# EasyEDA Pro project ProProject_Access Control Core_2024-06-07.epro, board V2.2.1 PCB
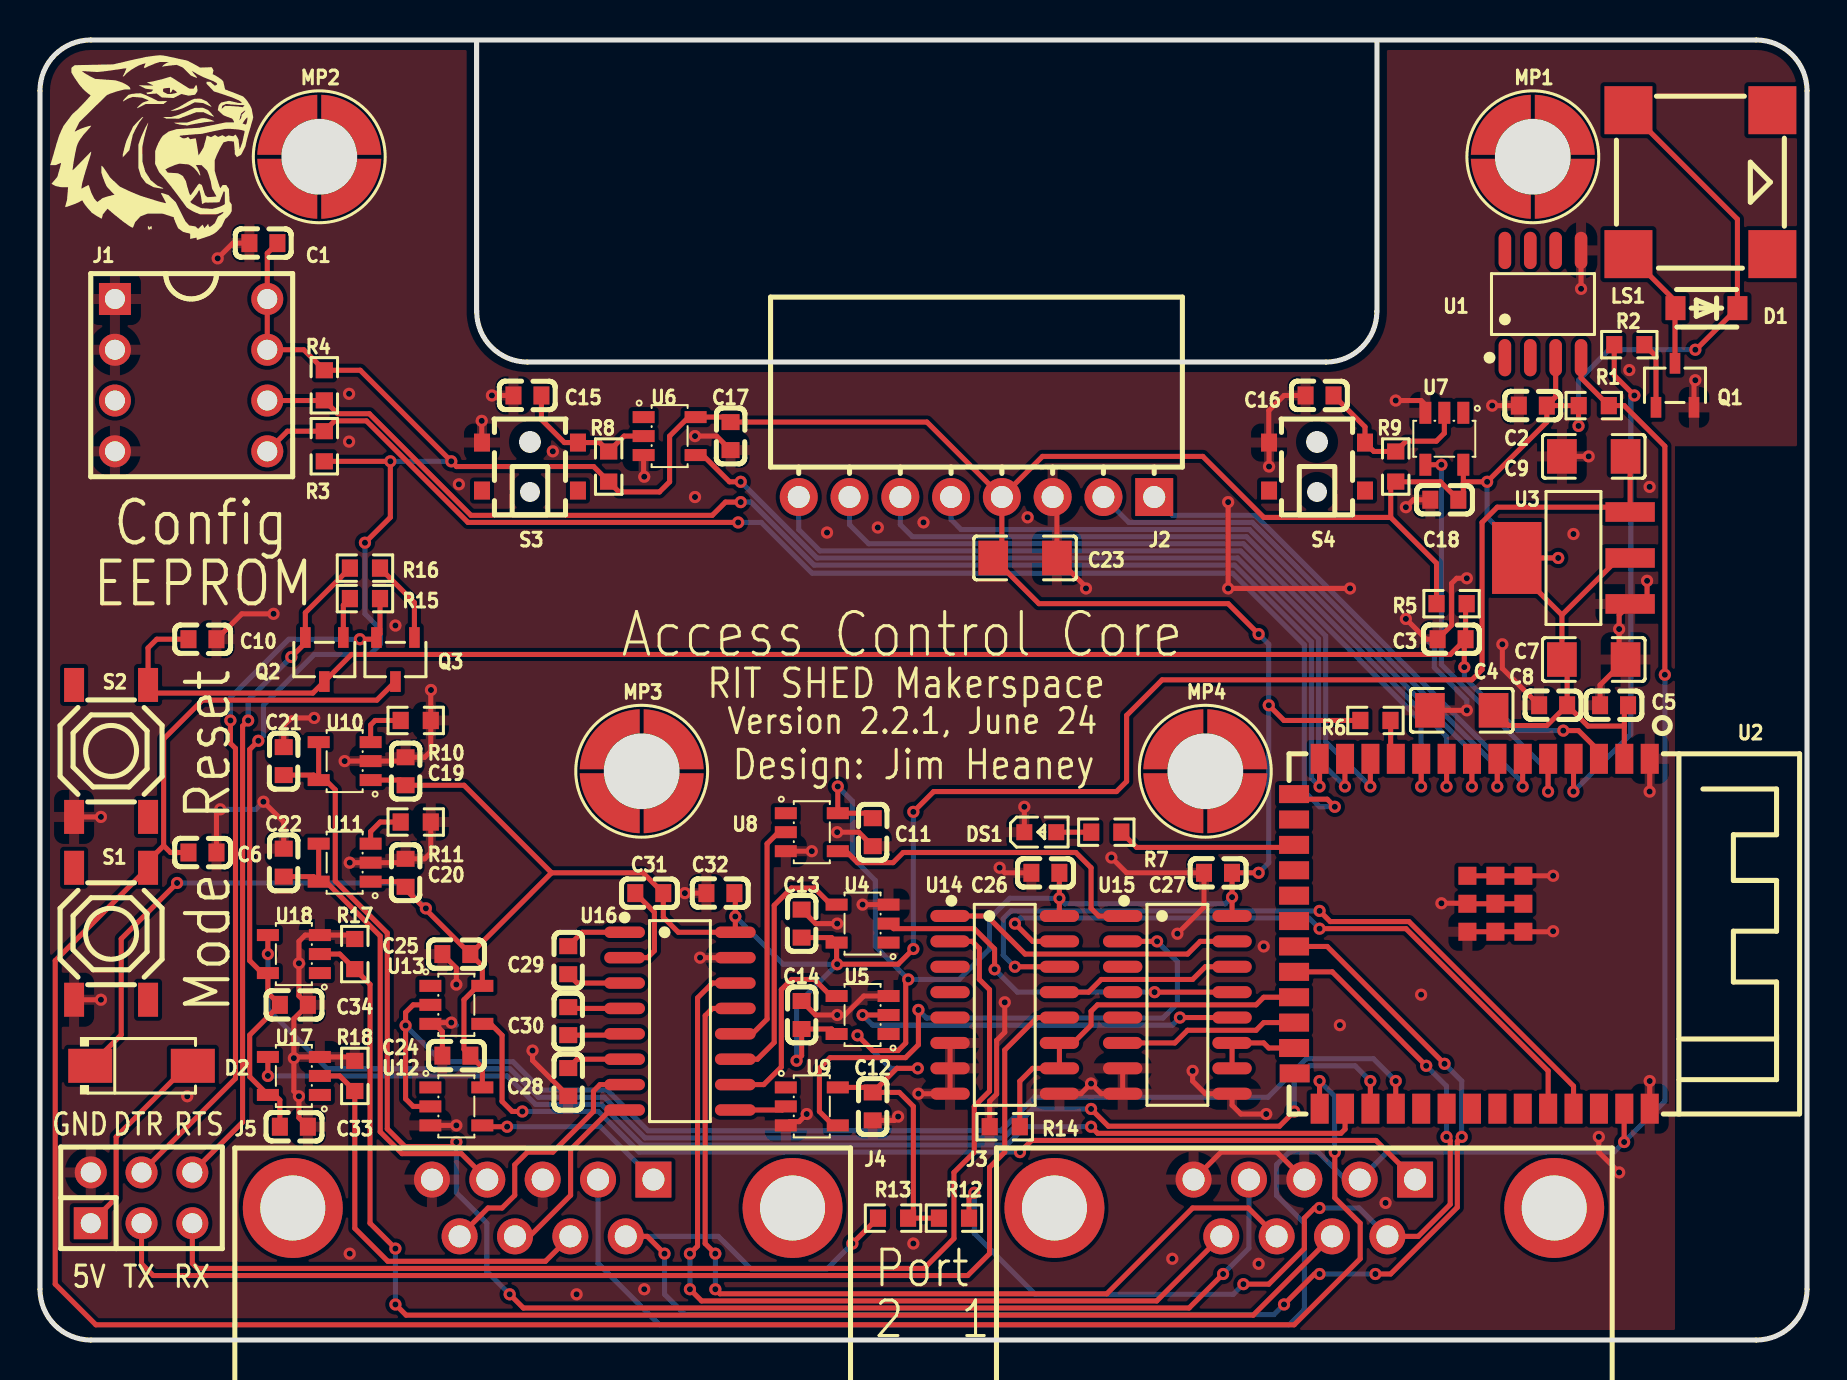
[diagram p15: board, top side]
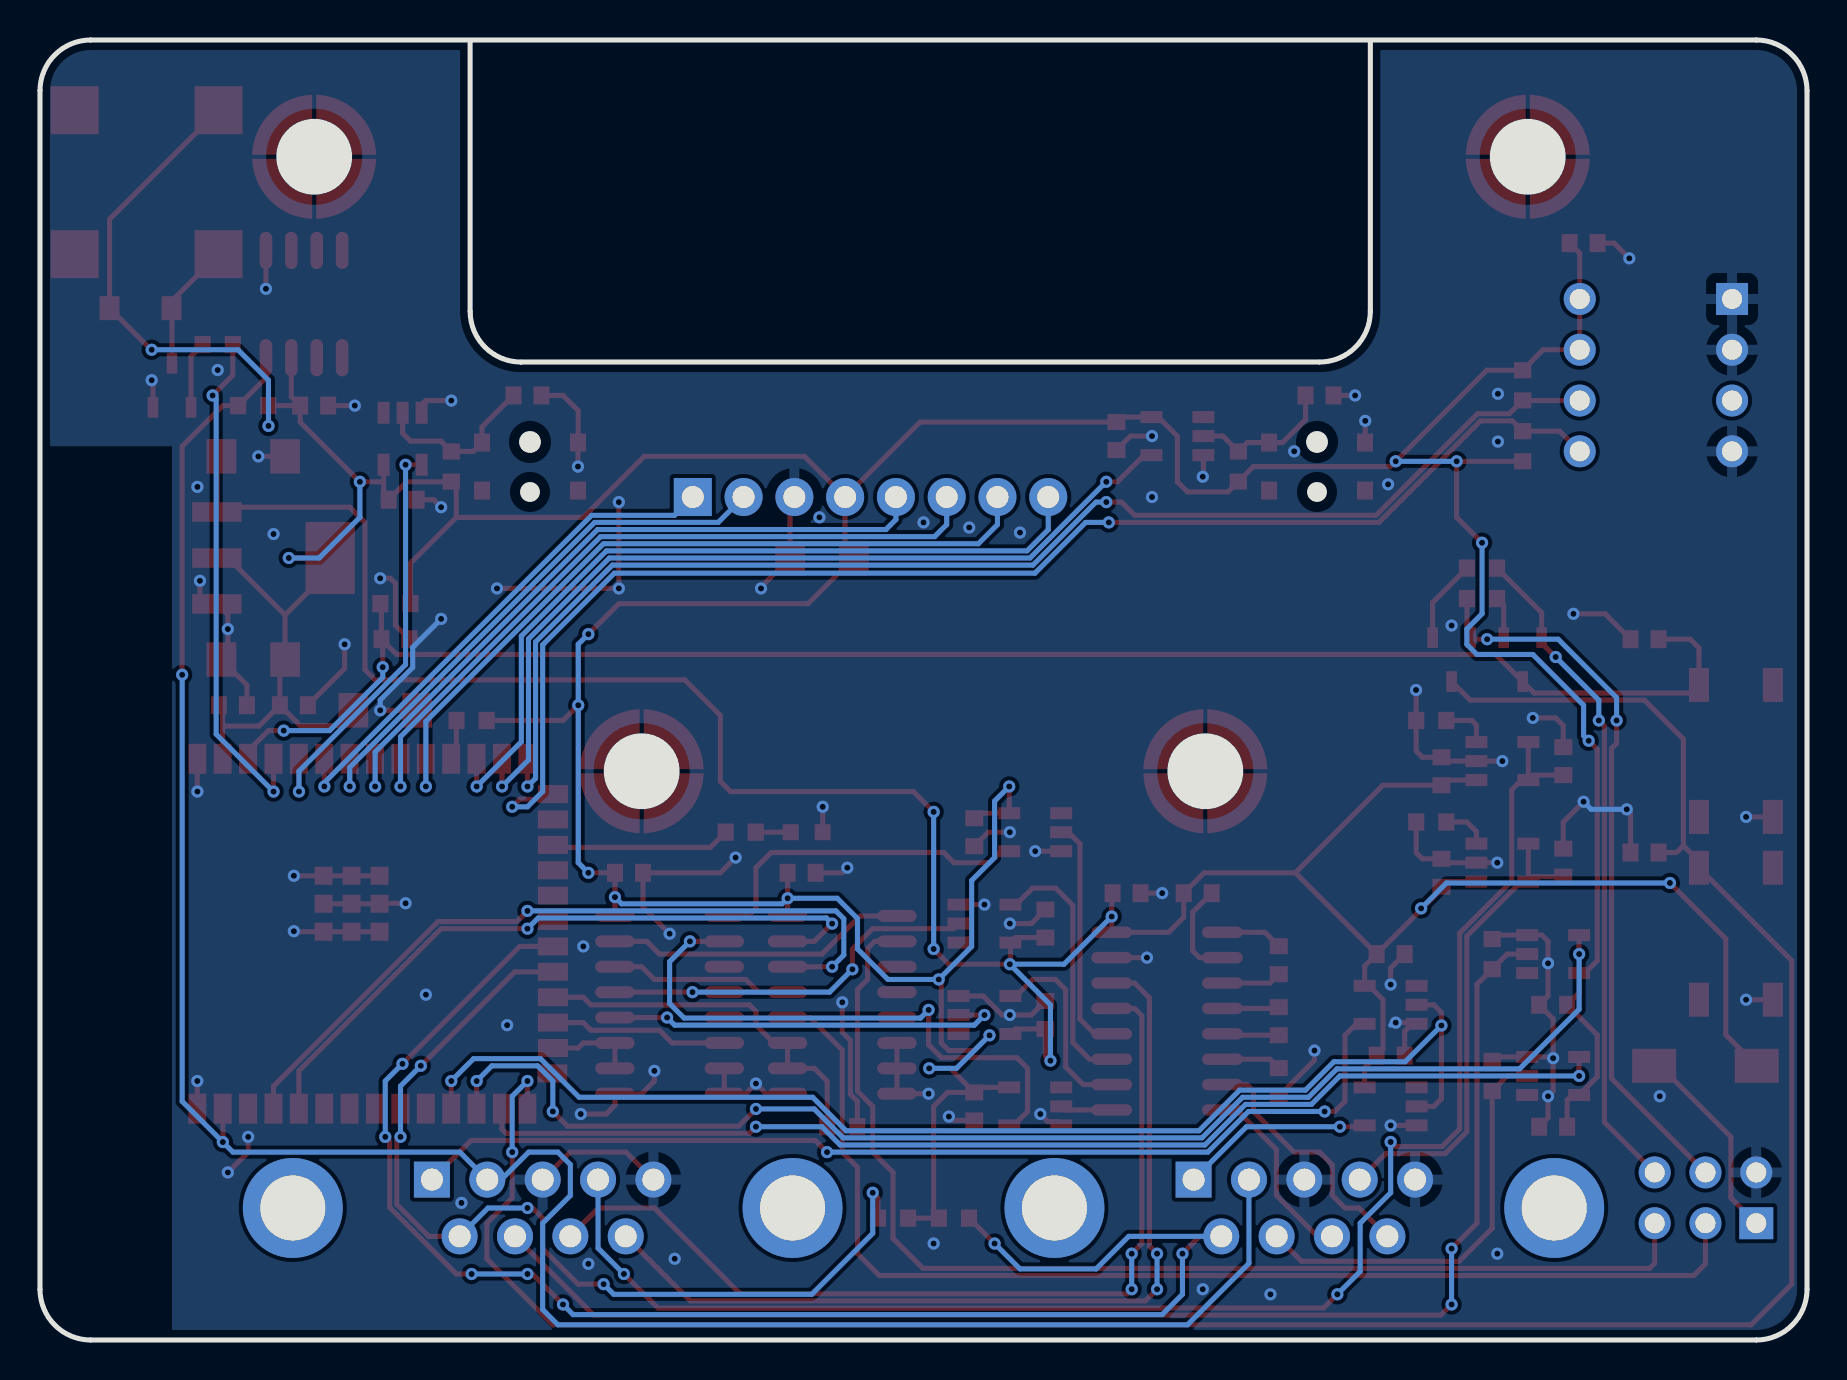
[diagram p16: board, bottom side, seen from below]

Outline 88.39 x 65.02 mm; copper layers: Top Layer, Bottom Layer. Coordinates in mm from the lower left corner of the outline.
Outline path: 21.84,64.98 21.84,51.46 arc(22.59,49.66) 24.38,48.92 64.34,48.92 arc(66.13,49.66) 66.88,51.46 66.88,65 ; 0,62.48 0,2.54 arc(0.74,0.74) 2.54,0 85.85,0 arc(87.65,0.74) 88.39,2.54 88.39,62.48 arc(87.65,64.28) 85.85,65.02 2.54,65.02 arc(0.74,64.28) 0,62.48
Stack: Top Layer 0.035mm / Dielectric1 1.51mm FR4 er 4.5 / Bottom Layer 0.035mm

## Design rules (mm)
template: Custom Config
spacing copperThickness1oz (default): track to track 0.102, other pairs 0.152 to 0.5
spacing copperThickness2oz: track to track 0.203, other pairs 0.152 to 0.3
track width copperThickness1oz (default): min 0.127, default 0.254, max 2.54
track width copperThickness2oz: min 0.203, default 0.254, max 2.54
differential pair differentialPair (default): width min 0.127, default 0.254, max 2.54; gap min 0.152, default 0.152
via viaSize (default): diameter min 0.5, default 0.61, max 10; hole min 0.3, default 0.305, max 6.3

## Placement (name value [footprint] x y rotation side)
C1  100nF  [C0603]  11.18 54.86 0 top
C2  100nF  [C0603]  74.68 46.74 0 top
C3  1uF  [C0603]  70.61 35.05 0 top
C4  22uF  [C1206]  71.12 31.5 0 top
C5  1uF  [C0603]  78.74 31.75 0 top
C6  100nF  [C0603]  8.13 24.38 180 top
C7  22uF  [C1206]  77.72 34.04 180 top
C8  100nF  [C0603]  75.69 31.75 0 top
C9  22uF  [C1206]  77.72 44.2 0 top
C10  100nF  [C0603]  8.13 35.05 180 top
C11  100nF  [C0603]  41.66 25.4 90 top
C12  100nF  [C0603]  41.66 11.68 90 top
C13  100nF  [C0603]  38.1 20.83 270 top
C14  100nF  [C0603]  38.1 16.26 270 top
C15  100nF  [C0603]  24.38 47.24 0 top
C16  100nF  [C0603]  64.01 47.24 0 top
C17  100nF  [C0603]  34.54 45.21 270 top
C18  100nF  [C0603]  70.25 42.03 180 top
C19  10uF  [C0603]  18.29 28.45 270 top
C20  10uF  [C0603]  18.29 23.37 270 top
C21  10uF  [C0603]  12.19 28.96 90 top
C22  10uF  [C0603]  12.19 23.88 90 top
C23  22uF  [C1206]  49.28 39.12 180 top
C24  100nF  [C0603]  20.83 14.22 180 top
C25  100nF  [C0603]  20.83 19.3 180 top
C26  100nF  [C0603]  50.29 23.37 180 top
C27  100nF  [C0603]  58.93 23.37 180 top
C28  1uF  [C0603]  26.43 12.9 90 top
C29  1uF  [C0603]  26.43 19 90 top
C30  1uF  [C0603]  26.43 15.95 90 top
C31  1uF  [C0603]  30.48 22.35 180 top
C32  1uF  [C0603]  34.04 22.35 0 top
C33  100nF  [C0603]  12.7 10.67 180 top
C34  100nF  [C0603]  12.7 16.76 180 top
D1  SM4007PL  [SOD-123F_L2.8-W1.8-LS3.7-RD]  83.36 51.61 180 top
D2  SS14  [SMA_L4.2-W2.6-LS5.3-RD]  5.08 13.72 0 top
DS1  KT-0603R  [LED0603-RD]  50.04 25.4 0 top
J1  IC-8P  [DIP-8_L10.2-W10.1-P2.54-LS7.6-BL]  7.56 48.26 270 top
J2  PM254-1-08-W-8.5  [HDR-TH_8P-P2.54-H-F-W10.0-N]  46.85 42.16 180 top
J3  D-SUB-DR-9PCM-CB  [DB9-TH_ID09S33E4GV00LF]  63.25 6.6 0 top
J4  D-SUB-DR-9PCM-CB  [DB9-TH_ID09S33E4GV00LF]  25.15 6.6 0 top
J5  DW254R-22-06-85  [HDR-TH_6P-P2.54-V-F-R2-C3-S2.54]  5.08 7.11 0 top
LS1  2.7kHz  [BUZ-SMD_4P-L8.5-W8.5-P8.50-TL]  83.06 57.91 0 top
MP1  SMTSO2070CTJ  [SMD_BD5.6-L5.6-W5.6-D3.6]  74.68 59.18 180 top
MP2  SMTSO2070CTJ  [SMD_BD5.6-L5.6-W5.6-D3.6]  13.97 59.18 0 top
MP3  SMTSO2070CTJ  [SMD_BD5.6-L5.6-W5.6-D3.6]  30.1 28.45 0 top
MP4  SMTSO2070CTJ  [SMD_BD5.6-L5.6-W5.6-D3.6]  58.29 28.45 0 top
Q1  S8050 J3Y  [SOT-23-3_L3.0-W1.7-P0.95-LS2.9-BR]  81.79 47.75 270 top
Q2  S8050 J3Y  [SOT-23-3_L3.0-W1.7-P0.95-LS2.9-BR]  14.22 34.04 90 top
Q3  S8050 J3Y  [SOT-23-3_L3.0-W1.7-P0.95-LS2.9-BR]  17.78 34.04 90 top
R1  4.7kΩ  [R0603]  77.72 46.74 180 top
R2  1kΩ  [R0603]  79.5 49.78 0 top
R3  10kΩ  [R0603]  14.22 44.7 270 top
R4  10kΩ  [R0603]  14.22 47.75 90 top
R5  10kΩ  [R0603]  70.61 36.83 180 top
R6  10kΩ  [R0603]  66.8 30.99 180 top
R7  4.7kΩ  [R0603]  53.34 25.4 0 top
R8  100kΩ  [R0603]  28.45 43.69 270 top
R9  100kΩ  [R0603]  67.82 43.69 270 top
R10  10kΩ  [R0603]  18.8 30.99 0 top
R11  10kΩ  [R0603]  18.8 25.91 0 top
R12  5.1kΩ  [R0603]  45.72 6.1 180 top
R13  5.1kΩ  [R0603]  42.67 6.1 0 top
R14  10kΩ  [R0603]  48.26 10.67 0 top
R15  10kΩ  [R0603]  16.26 37.08 180 top
R16  10kΩ  [R0603]  16.26 38.61 0 top
R17  10kΩ  [R0603]  15.75 19.3 90 top
R18  10kΩ  [R0603]  15.75 13.21 90 top
S1  TS-1187A-B-A-B  [SW-SMD_4P-L5.1-W5.1-P3.70-LS6.5-TL-2]  3.56 20.32 270 top
S2  TS-1187A-B-A-B  [SW-SMD_4P-L5.1-W5.1-P3.70-LS6.5-TL-2]  3.56 29.46 270 top
S3  TS-103  [SW-SMD_TS-103]  24.51 43.69 90 top
S4  TS-103  [SW-SMD_TS-103]  63.88 43.69 90 top
U1  DS18B20Z  [SOP-8_L4.9-W3.9-P1.27-LS6.0-BL]  75.18 51.82 0 top
U2  2.4GHz  [WIRELM-SMD_ESP32-S3-WROOM-1]  71.63 20.32 270 top
U3  AMS1117-3.3  [SOT-223-4_L6.5-W3.5-P2.30-LS7.0-BR]  76.71 39.12 0 top
U4  SN74LVC1G17DBVR  [SOT-23-5_L3.0-W1.7-P0.95-LS2.8-BR]  41.15 20.83 0 top
U5  SN74LVC1G17DBVR  [SOT-23-5_L3.0-W1.7-P0.95-LS2.8-BR]  41.15 16.26 0 top
U6  SN74LVC1G17DBVR  [SOT-23-5_L3.0-W1.7-P0.95-LS2.8-BR]  31.5 45.21 180 top
U7  SN74LVC1G17DBVR  [SOT-23-5_L3.0-W1.7-P0.95-LS2.8-BR]  70.25 45.08 90 top
U8  SN74LVC1G17DBVR  [SOT-23-5_L3.0-W1.7-P0.95-LS2.8-BR]  38.61 25.4 180 top
U9  SN74LVC1G17DBVR  [SOT-23-5_L3.0-W1.7-P0.95-LS2.8-BR]  38.61 11.68 180 top
U10  MT9700  [SOT-23-5_L3.0-W1.7-P0.95-LS2.8-BR]  15.24 28.96 0 top
U11  MT9700  [SOT-23-5_L3.0-W1.7-P0.95-LS2.8-BR]  15.24 23.88 0 top
U12  SN74LVC1G17DBVR  [SOT-23-5_L3.0-W1.7-P0.95-LS2.8-BR]  20.83 11.68 180 top
U13  SN74LVC1G17DBVR  [SOT-23-5_L3.0-W1.7-P0.95-LS2.8-BR]  20.83 16.76 180 top
U14  74HC4053D,653  [SOIC-16_L9.9-W3.9-P1.27-LS6.0-BL]  48.26 16.76 270 top
U15  74HC4053D,653  [SOIC-16_L9.9-W3.9-P1.27-LS6.0-BL]  56.9 16.76 270 top
U16  MAX232EESE-HXY  [SOP-16_L9.9-W3.9-P1.27-LS6.0-BL]  32.01 15.95 270 top
U17  SN74LVC1G17DBVR  [SOT-23-5_L3.0-W1.7-P0.95-LS2.8-BR]  12.7 13.21 0 top
U18  SN74LVC1G17DBVR  [SOT-23-5_L3.0-W1.7-P0.95-LS2.8-BR]  12.7 19.3 0 top

## Footprints (pads in the part's own frame, mm; a bottom-side part is the same pattern mirrored in y, then rotated)
BUZ-SMD_4P-L8.5-W8.5-P8.50-TL
  rect 2.4x2.4 smd: 1(-3.6,3.6) 2(-3.6,-3.6) 3(3.599,-3.599) 4(3.6,3.6)
C0603
  rect 0.8x0.9 smd: 1(-0.7,0) 2(0.7,0)
C1206
  rect 1.485x1.728 smd: 1(-1.593,0) 2(1.593,0)
DB9-TH_ID09S33E4GV00LF
  rect 1.8x1.8 hole 1.1: 1(5.54,1.42)
  round 1.8 hole 1.1: 2(2.77,1.42) 3(0,1.42) 4(-2.77,1.42) 5(-5.54,1.42) 6(4.155,-1.42) 7(1.385,-1.42) 8(-1.385,-1.42) 9(-4.155,-1.42)
  round 5 hole 3.25: 10(-12.5,0) 11(12.5,0)
DIP-8_L10.2-W10.1-P2.54-LS7.6-BL
  rect 1.6x1.6 hole 1: 1(-3.81,-3.81)
  round 1.6 hole 1: 2(-1.27,-3.81) 3(1.27,-3.81) 4(3.81,-3.81) 5(3.81,3.81) 6(1.27,3.81) 7(-1.27,3.81) 8(-3.81,3.81)
HDR-TH_6P-P2.54-V-F-R2-C3-S2.54
  rect 1.7x1.6 hole 1: 1(-2.54,-1.27)
  round 1.6 hole 1: 2(-2.54,1.27) 3(0,-1.27) 4(0,1.27) 5(2.54,-1.27) 6(2.54,1.27)
HDR-TH_8P-P2.54-H-F-W10.0-N
  rect 1.9x1.9 hole 1.1: 1(-8.89,0)
  round 1.9 hole 1.1: 2(-6.35,0) 3(-3.81,0) 4(-1.27,0) 5(1.27,0) 6(3.81,0) 7(6.35,0) 8(8.89,0)
LED0603-RD
  rect 0.8x0.8 smd: 1(-0.799,0) 2(0.799,0)
R0603
  rect 0.806x0.864 smd: 1(-0.753,0) 2(0.753,0)
SMA_L4.2-W2.6-LS5.3-RD
  rect 2.2x1.7 smd: 1(-2.566,0) 2(2.566,0)
SMD_BD5.6-L5.6-W5.6-D3.6
  custom 3x3 smd: 1(-1.844,1.6) 1(-1.601,-1.844) 1(1.6,1.844) 1(1.844,-1.6)
SOD-123F_L2.8-W1.8-LS3.7-RD
  rect 1x1.2 smd: 1(-1.55,0) 2(1.55,0)
SOIC-16_L9.9-W3.9-P1.27-LS6.0-BL
  oval 0.602x1.971 smd: 1(-4.445,-2.736) 2(-3.175,-2.736) 3(-1.905,-2.736) 4(-0.635,-2.736) 5(0.635,-2.736) 6(1.905,-2.736) 7(3.175,-2.736) 8(4.445,-2.736) 9(4.445,2.736) 10(3.175,2.736) 11(1.905,2.736) 12(0.635,2.736) 13(-0.635,2.736) 14(-1.905,2.736) 15(-3.175,2.736) 16(-4.445,2.736)
SOP-8_L4.9-W3.9-P1.27-LS6.0-BL
  oval 0.63x1.865 smd: 1(-1.905,-2.683) 2(-0.635,-2.683) 3(0.635,-2.683) 4(1.905,-2.683) 5(1.905,2.683) 6(0.635,2.683) 7(-0.635,2.683) 8(-1.905,2.683)
SOP-16_L9.9-W3.9-P1.27-LS6.0-BL
  oval 0.574x2.038 smd: 1(-4.445,-2.769) 2(-3.175,-2.769) 3(-1.905,-2.769) 4(-0.635,-2.769) 5(0.635,-2.769) 6(1.905,-2.769) 7(3.175,-2.769) 8(4.445,-2.769) 9(4.445,2.769) 10(3.175,2.769) 11(1.905,2.769) 12(0.635,2.769) 13(-0.635,2.769) 14(-1.905,2.769) 15(-3.175,2.769) 16(-4.445,2.769)
SOT-23-3_L3.0-W1.7-P0.95-LS2.9-BR
  rect 1.038x0.532 smd: 1(1.101,-0.95) 2(1.101,0.95) 3(-1.101,0)
SOT-23-5_L3.0-W1.7-P0.95-LS2.8-BR
  rect 1.1x0.6 smd: 1(1.3,-0.95) 2(1.3,0) 3(1.3,0.95) 4(-1.3,0.95) 5(-1.3,-0.95)
SOT-223-4_L6.5-W3.5-P2.30-LS7.0-BR
  rect 2.47x0.98 smd: 1(2.835,-2.3) 2(2.835,0) 3(2.835,2.3)
  rect 2.47x3.6 smd: 4(-2.835,0)
SW-SMD_4P-L5.1-W5.1-P3.70-LS6.5-TL-2
  rect 1.7x1 smd: 1(-3.3,1.85) 2(3.3,1.85) 3(-3.3,-1.85) 4(3.3,-1.85)
SW-SMD_TS-103
  rect 0.9x0.8 smd: 1(1.2,2.4) 2(1.2,-2.4) 3(-1.2,2.4) 4(-1.2,-2.4)
WIRELM-SMD_ESP32-S3-WROOM-1
  rect 1.5x0.9 smd: 1(-8.75,8.895) 2(-8.75,7.625) 3(-8.75,6.355) 4(-8.75,5.085) 5(-8.75,3.815) 6(-8.75,2.545) 7(-8.75,1.275) 8(-8.75,0.005) 9(-8.75,-1.265) 10(-8.75,-2.535) 11(-8.75,-3.805) 12(-8.75,-5.075) 13(-8.75,-6.345) 14(-8.75,-7.615) 27(8.75,-7.615) 28(8.75,-6.345) 29(8.75,-5.075) 30(8.75,-3.805) 31(8.75,-2.535) 32(8.75,-1.265) 33(8.75,0.005) 34(8.75,1.275) 35(8.75,2.545) 36(8.75,3.815) 37(8.75,5.085) 38(8.75,6.355) 39(8.75,7.625) 40(8.75,8.895)
  rect 0.9x1.5 smd: 15(-6.985,-8.895) 16(-5.715,-8.895) 17(-4.445,-8.895) 18(-3.175,-8.895) 19(-1.905,-8.895) 20(-0.635,-8.895) 21(0.635,-8.895) 22(1.905,-8.895) 23(3.175,-8.895) 24(4.445,-8.895) 25(5.715,-8.895) 26(6.985,-8.865)
  rect 0.9x0.9 smd: 41(-2.9,2.575) 41(-2.9,1.175) 41(-2.9,-0.225) 41(-1.5,2.575) 41(-1.5,1.175) 41(-1.5,-0.225) 41(-0.1,2.575) 41(-0.1,1.175) 41(-0.1,-0.225)

## Nets
As in the schematic.

Pads without a net: J1 3; J3 10 11; J4 10 11; LS1 3 4; MP1 1; MP2 1; MP3 1; MP4 1; S1 2 3; S2 2 3; S3 3 4; S4 3 4; U1 1 2 6 7 8; U2 16 18 19 20 26 31 32 33 34 35 38; U4 1; U5 1; U6 1; U7 1; U8 1; U9 1; U12 1; U13 1; U14 3 4 5; U15 3 4 5; U17 1; U18 1

## Via types
v1: diameter 0.61, hole 0.305, Top Layer to Bottom Layer, 179 vias

## Routing (per net, layer and track width the routed paths; a pad name or vN(x,y) marks a point on that pad's centre or on a via; arc(x,y) is an arc through that point)
+5V: length 148.8
  Top Layer w0.254: C25.1 22.13,18.7 U13.5 21.91,17.71 21.21,17.02 21.21,14.54 C24.1 22.13,13.62 U12.5 ; C25.1 25.59,23.37 ; C25.1 19.24,21.59 ; v1(43.69,26.42) 44.7,27.43 53.85,27.43 54.36,27.94 54.36,31.24 56.13,33.02 71.63,33.02 72.14,33.53 72.14,40.89 72.9,41.66 79.3,41.66 U3.3 79.54,43.97 C9.2 ; C13.2 39.6,20.13 U4.5 39.85,18.83 v1(39.88,18.8) 42.93,18.8 v1(43.69,19.56) ; D2.1 4.06,15.27 4.06,20.07 v1(6.86,22.86) ; 25.59,23.37 30.16,23.37 C31.1 31.18,21.14 31.93,20.39 U16.16 v1(34.78,21.18) 34.78,22.31 C32.2 ; 25.59,23.37 21.21,27.75 C19.2 18.03,28.01 U10.1 ; v1(19.3,21.59) 19.24,21.59 ; 19.24,21.59 18.29,22.54 C20.2 18.03,22.93 U11.1 ; v1(37.85,13.97) 38.1,14.22 C14.2 39.6,15.56 U5.5
  Bottom Layer w0.254: v1(19.3,21.59) 18.03,22.86 v1(6.86,22.86) ; v1(37.85,13.97) 37.85,16.76 v1(39.88,18.8) 37.17,18.8 v1(34.78,21.18) ; v1(43.69,19.56) v1(43.69,26.42)
GND: length 192.6
  Top Layer w0.254: v1(77.98,10.16) 77.98,9.4 v1(78.99,8.38) ; U12.3 v1(20.83,10.73) ; S2.4 v1(3.05,26.16) ; C9.1 v1(77.47,44.2) ; R11.2 19.55,24.38 19.24,24.07 C20.1 18.1,23.88 U11.2 v1(15.49,23.88) ; v1(73.15,34.8) 73.15,33.59 C8.1 ; R18.2 15.55,14.16 U17.3 12.76,14.16 v1(12.7,14.1) ; C24.2 20.13,15.43 19.75,15.81 ; U9.3 37.5,10.92 37.97,10.92 v1(38.35,11.3) ; U4.3 v1(41.15,21.78) ; v1(68.33,41.66) 68.7,42.03 C18.2 ; v1(70.1,21.84) 71.38,21.84 U2.41 U2.41 74.2,21.82 ; C32.1 v1(32.26,22.35) ; U5.3 41.21,17.21 40.26,16.26 v1(39.88,16.26) 38.8,16.26 C14.1 ; J3.5 59.08,9.4 61.87,9.4 J3.3 ; v1(22.1,45.97) 22.1,44.9 22.11,44.89 ; v1(48.26,16.89) 48.26,15.39 47.85,14.99 47.85,12.3 47.51,11.95 R14.1 ; C12.1 42.73,10.98 v1(42.93,11.18) ; C11.1 40.96,25.4 v1(39.88,25.4) ; v1(80.52,27.43) 80.52,27.44 U2.1 ; v1(12.7,14.1) 12.7,16.06 C34.1 12.95,17.21 v1(12.95,18.84) 12.95,19.94 13.27,20.25 U18.3 15.55,20.25 R17.2 ; v1(12.7,14.1) 12.7,12.45 v1(12.95,12.19) 12.95,11.11 C33.1 ; U16.15 v1(33.02,19.12) ; S1.4 v1(3.05,17.02) ; v1(13.72,31.12) 12.57,31.12 12.19,30.73 C21.2 ; v1(15.24,28.96) U10.2 18.1,28.96 C19.1 19.24,29.15 19.55,29.46 R10.2 19.55,32.5 v1(19.56,32.51) ; v1(48.01,23.62) 48.26,23.37 C26.2 ; v1(43.94,12.32) U14.8 U14.7 U14.6 ; C1.1 9.65,54.86 v1(8.89,54.1) ; U7.3 69.3,46.78 69.09,46.99 v1(67.82,46.99) ; v1(20.57,15.88) 19.81,15.88 19.75,15.81 ; v1(24.64,14.48) 24.64,13.99 C28.1 ; v1(61.34,11.3) 60.07,11.3 59.63,11.74 U15.9 58.29,12.32 57.66,12.95 v1(57.66,13.46) ; v1(82.8,48.01) 82.74,47.94 Q1.2 ; v1(9.02,26.54) 8.83,26.35 C6.1 ; v1(68.33,36.07) 69.34,35.05 C3.1 70.61,35.75 70.61,37.85 70.87,38.1 v1(71.37,38.1) ; U15.7 U15.8 53.09,12.32 v1(52.58,12.83) 52.07,12.32 U14.9 ; v1(11.18,26.92) 12.19,25.91 C22.2 ; C17.2 33.84,45.21 v1(32.77,45.21) ; U6.3 30.2,43.21 v1(30.23,43.18) ; v1(53.59,24.13) 54.36,23.37 C27.2 58.23,21.65 v1(56.9,20.32) ; v1(71.37,31.5) C4.1 ; v1(52.32,37.59) 52.32,37.66 C23.1 50.87,41.95 J2.3 ; U2.41 U2.41 v1(75.69,23.22) ; v1(61.48,43.69) S4.1 61.47,44.9 61.47,46.48 62.23,47.24 C16.1 ; v1(22.61,47.24) C15.1 ; C10.1 10.1,36.32 v1(11.68,36.32) ; C13.1 38.8,20.83 v1(39.88,20.83) ; DS1.1 v1(49.24,26.67) ; U8.3 v1(38.61,24.45) ; v1(59.44,41.91) v1(59.44,37.59) v1(65.53,37.59) ; v1(20.83,17.78) 20.83,18.6 C25.2 ; U2.40 v1(80.52,12.95) ; 19.75,15.81 U13.3 ; C2.1 v1(72.64,46.74) ; v1(75.69,20.45) 75.66,20.42 U2.41 U2.41 ; v1(80.39,37.97) 80.39,36.96 80.25,36.82 U3.1 78.99,36.27 v1(78.99,35.56) 78.99,34.36 C7.1 78.04,32.76 C5.1 ; 77.09,54.59 v1(77.09,52.58)
  Bottom Layer w0.254: v1(48.26,16.89) 48.13,17.02 ; v1(20.57,15.88) 20.7,15.88 20.83,15.75 ; v1(11.18,26.92) 10.8,26.54 v1(9.02,26.54) ; v1(33.02,19.12) 33.02,19.3 ; v1(77.09,52.58) 77.22,52.58 ; v1(75.69,23.22) 75.69,23.37 ; v1(61.34,11.3) 61.34,11.18 ; v1(61.48,43.69) 61.47,43.69 ; v1(68.33,36.07) 69.75,34.65 69.75,33.63 71.37,32.01 v1(71.37,31.5) ; v1(80.39,37.97) 80.52,37.97 ; v1(49.24,26.67) 49.28,26.67
  vias: v1(7.37,12.19) v1(15.46,47.33) v1(15.46,44.94) v1(15.49,4.32) v1(17.78,35.74) v1(20.95,42.8) v1(25.65,44.45) v1(26.84,2.29) v1(30.23,2.54) v1(32.77,42.16) v1(39.37,40.39) v1(41.91,40.64) v1(43.69,4.83) v1(44.2,40.89) v1(49.4,41.15) v1(56.64,4.06) v1(60.96,3.81) v1(61.21,19.69) v1(65.02,15.75) v1(67.31,6.86) v1(69.09,17.27) v1(76.71,40.31) v1(79.5,48.51) v1(80.52,42.67)
VCC: length 296.2
  Top Layer w0.254: J2.4 50.15,44.2 58.17,44.2 61.22,41.14 67.57,41.14 ; J2.4 48.12,39.55 C23.2 49.97,36.83 59.44,36.83 v1(60.96,35.31) ; J2.4 44.37,45.91 C17.1 34.29,46.16 U6.5 32.45,46.16 31.5,45.21 31.5,42.93 30.99,42.42 28.96,42.42 R8.2 27.69,43.69 20.84,43.69 v1(20.57,43.95) 16.02,48.51 R4.2 13.2,49.53 J1.7 J1.8 11.37,54.36 C1.2 ; U9.5 41.41,12.63 C12.2 ; LS1.1 84.91,56.06 D1.1 82.83,49.53 v1(82.8,49.53) ; 76.13,36.26 73.87,38.52 U3.4 v1(75.95,39.12) ; 76.13,36.26 C7.2 76.39,33.78 C8.2 ; 76.13,36.26 78.98,39.12 U3.2 ; 59.63,23.36 59.63,23.37 v1(60.96,23.37) ; 59.63,23.36 C27.1 ; 59.63,23.36 v1(59.63,22.15) U15.16 ; 75.82,49.04 75.82,47.18 C2.2 ; R5.2 69.86,38.85 67.57,41.14 ; R12.2 R13.2 43.69,6.36 43.69,11.68 42.99,12.38 C12.2 ; 67.83,42.93 70.05,42.93 C18.1 71.2,42.28 71.2,42.88 ; 67.83,42.93 67.57,42.67 67.57,41.14 ; 67.83,42.93 R9.2 ; v1(76.96,45.72) 76.96,46.73 R1.2 C2.2 ; 71.2,42.88 71.25,42.93 v1(72.39,42.93) 75.38,45.91 C2.2 ; 71.2,42.88 U7.5 ; C11.2 41.41,26.35 U8.5 v1(39.91,27.69) ; C8.2 77.44,30.71 79.25,30.71 ; C8.2 75.38,30.73 73.47,30.73 C4.2 ; v1(16.26,39.88) 17.53,41.15 v1(17.53,43.95) R3.2 ; U14.16 50.99,21.21 v1(50.99,22.1) C26.1 ; C5.2 79.25,31.56 79.25,30.71 ; C12.2 42.86,13.59 v1(43.91,13.59) ; C33.2 12,12 11.75,12.26 U17.5 10.49,13.17 10.49,15.25 C34.2 11.4,17.36 U18.5 11.11,18.35 10.49,18.97 10.49,29.54 v1(10.92,29.97) ; v1(43.43,18.03) 43.31,17.91 43.31,14.86 42.93,14.48 41.66,14.48 v1(40.89,15.24) ; 79.25,30.71 U2.2 ; v1(61.47,31.75) 62.23,30.99 R6.2
  Bottom Layer w0.254: v1(17.53,43.95) v1(20.57,43.95) ; v1(75.95,39.12) 74.42,39.12 72.39,41.15 v1(72.39,42.93) ; v1(59.63,22.15) 59.3,21.82 51.27,21.82 v1(50.99,22.1) 48.51,22.1 47.5,21.08 47.5,19.56 45.97,18.03 v1(43.43,18.03) 41.79,19.68 41.79,22.98 40.64,24.13 40.64,26.95 v1(39.91,27.69) 39.88,27.69 ; v1(43.91,13.59) 42.54,13.59 v1(40.89,15.24) ; v1(60.96,35.31) 61.47,34.8 v1(61.47,31.75) 61.47,23.88 v1(60.96,23.37) ; v1(76.96,45.72) 76.96,48.01 78.49,49.53 v1(82.8,49.53) ; v1(16.26,39.88) 16.26,36.32 17.02,35.56 17.02,34.8 16.51,34.29 13.72,34.29 11.18,31.75 11.18,30.23 v1(10.92,29.97)
232OUT_EN: length 9
  Top Layer w0.254: 62.73,15.88 61.21,15.88 60.83,15.49 57.4,15.49 56.77,14.86 U15.6
232OUT_SEL: length 4.5
  Top Layer w0.254: U15.10 U15.11 61.21,14.86 61.47,14.61 U2.25
BUZZER: length 25.7
  Top Layer w0.254: v1(76.71,27.43) 76.71,27.44 U2.4 ; v1(79.76,47.24) 78.75,48.25 R2.1
  Bottom Layer w0.254: v1(79.76,47.24) 79.58,47.07 79.58,30.3 v1(76.71,27.43)
CS_NFC: length 35.1
  Top Layer w0.254: U2.8 71.63,29.07 v1(71.63,27.69)
  Bottom Layer w0.254: J2.5 45.58,41.04 46.08,40.54 60.5,40.54 71.63,29.41 v1(71.63,27.69)
DB9_INT1: length 68.4
  Top Layer w0.254: J3.7 60.69,1.24 18.31,1.24 v1(17.78,1.78) ; U18.2 14.99,19.3 R17.1 16.51,17.79 16.51,5.84 v1(17.78,4.57)
  Bottom Layer w0.254: v1(17.78,1.78) v1(17.78,4.57)
DB9_INT2: length 20.9
  Top Layer w0.254: 26.53,5.18 25.28,3.94 17.4,3.94 15.75,5.59 R18.1 14.99,13.21 U17.2
DEBUG_LED: length 9
  Top Layer w0.254: R7.2 54.86,24.64 62.61,24.64 U2.17
DTR: length 36.4
  Top Layer w0.254: v1(16,35.05) 16.74,35.05 Q3.2 17.01,35.32 R15.1 ; J5.4 9.78,13.08 9.78,29.59 9.52,29.85 v1(9.52,30.99)
  Bottom Layer w0.254: v1(9.52,30.99) 9.52,32.13 12.45,35.05 v1(16,35.05)
EN: length 83.5
  Top Layer w0.254: R5.1 71.31,36.78 C3.2 71.25,34.99 ; v1(71.25,33.66) 71.25,34.99 ; 71.25,34.99 70.55,34.29 15.58,34.29 Q2.3 13.65,32.36 5.81,32.36 S2.1 5.41,34.62 5.84,35.05 C10.2 ; v1(76.2,30.48) 76.96,30.48 77.98,29.46 77.98,29.07
  Bottom Layer w0.254: v1(71.25,33.66) 71.25,33.14 73.91,30.48 v1(76.2,30.48)
GPIO0: length 122.3
  Top Layer w0.254: C6.2 6.53,24.38 6.19,24.73 ; 6.19,24.73 5.41,23.95 S1.1 0.76,18.98 0.76,2.79 2.79,0.76 62.74,0.76 66.04,4.06 66.04,5.84 64.77,7.11 v1(64.77,9.4) ; 6.19,24.73 6.19,30.06 8.13,32 16.85,32 Q3.3 ; v1(64.01,12.95) 64.01,11.58 U2.27
  Bottom Layer w0.254: v1(64.01,12.95) 64.77,12.19 v1(64.77,9.4)
INT1: length 66.3
  Top Layer w0.254: v1(62.74,11.43) 62,10.69 53.44,10.69 v1(52.58,11.56) ; v1(66.55,12.95) 66.55,11.58 U2.29 ; U18.4 v1(11.4,19.3)
  Bottom Layer w0.254: v1(52.58,11.56) 49.66,11.56 48.21,10.11 30.27,10.11 28.23,12.14 24.94,12.14 23.51,13.56 14.38,13.56 11.4,16.54 v1(11.4,19.3) ; v1(66.55,12.95) 65.79,13.72 63.5,13.72 62.74,12.95 v1(62.74,11.43)
INT2: length 57.9
  Top Layer w0.254: U17.4 v1(11.4,13.21) ; v1(52.58,10.67) 52.91,10.34 65.08,10.34 65.28,10.55 U2.28
  Bottom Layer w0.254: v1(11.4,13.21) 23.37,13.21 24.79,11.79 28.09,11.79 30.12,9.75 48.36,9.75 49.28,10.67 v1(52.58,10.67)
IO18: length 2
  Top Layer w0.254: 67.82,29.07 67.56,29.33 67.56,31
IRQ: length 27.6
  Top Layer w0.254: U2.7 72.9,29.07 v1(72.9,27.69)
  Bottom Layer w0.254: J2.2 54.47,40.89 60.65,40.89 72.9,28.64 v1(72.9,27.69)
MISO: length 38.7
  Top Layer w0.254: U2.10 69.09,27.69 v1(69.09,27.69)
  Bottom Layer w0.254: J2.7 40.5,40.78 41.45,39.83 60.2,39.83 69.09,30.94 v1(69.09,27.69)
MOSI: length 37
  Top Layer w0.254: U2.9 70.36,27.69 v1(70.36,27.69)
  Bottom Layer w0.254: v1(70.36,27.69) 70.36,30.18 60.35,40.18 43.64,40.18 43.04,40.78 J2.6
NO: length 62.2
  Top Layer w0.254: U12.2 18.67,11.68 18.29,12.07 v1(18.29,15.73) 18.29,16.38 18.67,16.76 U13.2 ; 67.82,11.57 67.82,11.58 v1(67.82,12.95)
  Bottom Layer w0.254: v1(67.82,12.95) 66.7,14.07 63.35,14.07 61.42,12.14 49.74,12.14 48.07,10.47 30.41,10.47 28.38,12.5 25.08,12.5 23.66,13.92 20.1,13.92 v1(18.29,15.73)
NO_HV1: length 52.3
  Top Layer w0.254: v1(24.13,11.43) 23.62,11.43 23.11,11.94 23.11,15.24 22.54,15.81 U13.4 ; v1(49.02,9.4) 49.61,9.98 66.83,9.98 J3.1
  Bottom Layer w0.254: v1(24.13,11.43) 27.94,11.43 29.97,9.4 v1(49.02,9.4)
NO_HV2: length 9.7
  Top Layer w0.254: U12.4 22.19,10.67 v1(23.37,10.67)
  Bottom Layer w0.254: J4.1 28.04,10.67 v1(23.37,10.67)
RS232RX1: length 46.1
  Top Layer w0.254: v1(33.78,4.32) 33.27,4.83 33.27,16.22 33.64,16.58 U16.13 ; J3.8 60.44,6.6 57.66,6.6 53.37,2.31 34.01,2.31 v1(33.78,2.54)
  Bottom Layer w0.254: v1(33.78,4.32) v1(33.78,2.54)
RS232RX2: length 9.4
  Top Layer w0.254: J4.8 24.49,5.18 26.54,7.24 26.54,9.53 28.52,11.5 U16.8
RS232TX1: length 45.1
  Top Layer w0.254: v1(32.51,2.54) 33.1,1.96 55.86,1.96 J3.9 ; U16.14 33.64,17.85 32.89,17.11 32.89,4.7 v1(32.51,4.32)
  Bottom Layer w0.254: v1(32.51,2.54) v1(32.51,4.32)
RS232TX2: length 12.9
  Top Layer w0.254: U16.7 28.01,12.77 27.69,12.45 27.69,11.43 25.65,9.4 24.38,9.4 23.75,8.76 23.75,7.24 23.11,6.6 22.41,6.6 20.99,5.18
RSTO: length 25.9
  Top Layer w0.254: U2.6 74.17,29.07 v1(74.17,27.69)
  Bottom Layer w0.254: J2.1 56.65,41.25 60.79,41.25 74.17,27.88 v1(74.17,27.69)
RTS: length 33.5
  Top Layer w0.254: J5.6 10.13,10.9 10.13,30.71 v1(10.41,30.99) ; R16.1 13.27,36.38 Q2.2 13.27,34.86 v1(12.57,34.16)
  Bottom Layer w0.254: v1(10.41,30.99) 10.41,32 v1(12.57,34.16)
RX: length 34.4
  Top Layer w0.254: v1(48.77,20.83) 49.66,19.94 U14.15 ; U2.36 75.44,13.46 68.33,20.57 v1(64.01,20.57)
  Bottom Layer w0.254: v1(48.77,20.83) 49.05,21.11 63.47,21.11 v1(64.01,20.57)
RX1: length 17.2
  Top Layer w0.254: U8.4 40.32,24.45 40.89,23.88 42.67,23.88 43.18,24.38 51.82,24.38 52.58,23.62 52.58,21.59 52.96,21.21 U15.1
RX1_HV: length 11.8
  Top Layer w0.254: U16.12 35.63,15.31 36.37,16.05 36.37,24.82 36.95,25.4 U8.2
RX2: length 29.2
  Top Layer w0.254: U15.2 v1(55.88,19.94) ; v1(43.94,16.51) 43.94,14.77 43.3,14.12 39.52,14.12 38.99,13.59 38.99,11.43 39.69,10.73 U9.4
  Bottom Layer w0.254: v1(55.88,19.94) 56.9,18.92 56.9,16.83 56.17,16.1 44.35,16.1 v1(43.94,16.51)
RX2_HV: length 2.6
  Top Layer w0.254: U16.9 37.13,11.5 U9.2
RX232: length 15.2
  Top Layer w0.254: U14.1 47.37,21.21 49.28,19.3 57.4,19.3 58.04,19.94 U15.15
RXP: length 57.9
  Top Layer w0.254: J5.5 7.62,3.84 7.87,3.58 44.22,3.58 45.72,5.08 45.72,8.38 46.74,9.4 46.74,11.68 47.5,12.45 47.5,17.53 46.99,18.03 46.99,19.59 46.64,19.94 U14.2
SCK: length 40
  Top Layer w0.254: U2.12 66.55,29.07 v1(66.55,27.69)
  Bottom Layer w0.254: v1(66.55,27.69) 64.31,29.92 64.31,35.21 60.06,39.47 39.01,39.47 37.96,40.53 J2.8
SCL: length 66.6
  Top Layer w0.254: J1.6 14.22,46.99 R4.1 14.89,46.33 16.48,46.33 21.56,41.25 33.63,41.25 34.29,41.91 v1(35.05,41.91) ; v1(64.01,27.69) 64.01,29.07 U2.14
  Bottom Layer w0.254: v1(64.01,27.69) 63.6,28.09 63.6,34.92 59.76,38.76 38.72,38.76 35.57,41.91 v1(35.05,41.91)
SDA: length 68.6
  Top Layer w0.254: J1.5 12.38,45.46 R3.1 14.74,45.97 16.33,45.97 21.41,40.89 v1(34.93,40.89) ; U2.15 62.99,27.05 64.39,27.05 v1(64.77,26.67)
  Bottom Layer w0.254: v1(34.93,40.89) 36.08,40.89 38.62,38.35 59.66,38.35 63.25,34.77 63.25,27.43 64.01,26.67 v1(64.77,26.67)
SW_TYPE1: length 48.4
  Top Layer w0.254: v1(64.01,6.6) 63.75,6.6 63.25,6.1 63.25,4.57 61.47,2.79 v1(60.2,2.79) ; U2.22 64.64,18.42 v1(69.34,13.72) ; v1(46.74,7.37) 46.47,7.1 R12.1 ; v1(70.36,10.16) 70.54,9.97 70.54,6.78 68.94,5.18 J3.6
  Bottom Layer w0.254: v1(69.34,13.72) 70.36,12.7 v1(70.36,10.16) ; J3.6 65.98,6.6 v1(64.01,6.6) ; v1(60.2,2.79) 59.69,2.29 49.78,2.29 46.74,5.33 v1(46.74,7.37)
SW_TYPE2: length 78.6
  Top Layer w0.254: U2.21 64.39,19.69 v1(70.26,13.81) ; v1(31.24,4.32) 30.38,5.18 J4.6 ; v1(40.64,4.83) 41.91,6.1 R13.1 ; v1(71.12,10.16) 70.9,9.94 70.9,6.64 67.56,3.3 v1(66.8,3.3) ; v1(64.01,3.3) 63.75,3.3 v1(62.23,1.78)
  Bottom Layer w0.254: v1(70.26,13.81) 71.12,12.95 v1(71.12,10.16) ; J4.6 33.93,5.18 35.56,3.56 39.37,3.56 v1(40.64,4.83) ; v1(62.23,1.78) 61.72,1.27 32.26,1.27 31.24,2.29 v1(31.24,4.32) ; v1(64.01,3.3) v1(66.8,3.3)
SWITCH1: length 44.3
  Top Layer w0.254: U2.13 65.28,29.07 v1(65.28,27.69) ; U6.4 33.16,44.26 34.49,42.93 v1(35.05,42.93)
  Bottom Layer w0.254: v1(65.28,27.69) 63.96,29.01 63.96,35.07 59.91,39.12 38.87,39.12 35.06,42.93 v1(35.05,42.93)
SWITCH2: length 21
  Top Layer w0.254: v1(75.44,27.43) 75.44,29.07 U2.5 ; U7.4 v1(70.1,43.78)
  Bottom Layer w0.254: v1(70.1,43.78) 70.1,33.78 75.44,28.45 v1(75.44,27.43)
TEMP: length 111.8
  Top Layer w0.254: U2.39 79.24,11.56 v1(79.24,9.9) ; v1(81.28,33.27) 81.28,44.7 79.25,46.74 R1.1 77.09,48.12 77.09,49.04
  Bottom Layer w0.254: v1(81.28,33.27) 81.28,11.94 v1(79.24,9.9) 78.74,9.4 67.39,9.4 J3.2 65.32,8.02 63.94,9.4 62.48,9.4 61.86,8.78 61.86,7.23 63.25,5.84 63.25,1.52 62.48,0.76 30.99,0.76 27.92,3.83 J4.2
TX: length 38.3
  Top Layer w0.254: U2.37 76.71,12.7 68.48,20.93 64.54,20.93 v1(64.01,21.46) ; U14.14 v1(48.77,18.67)
  Bottom Layer w0.254: v1(64.01,21.46) 48.58,21.46 48.18,21.07 48.18,19.25 v1(48.77,18.67)
TX1: length 19.2
  Top Layer w0.254: U4.2 42.7,20.57 46.74,20.57 47.75,19.56 v1(47.75,18.54) ; v1(55.75,17.4) U15.13
  Bottom Layer w0.254: v1(55.75,17.4) 48.9,17.4 v1(47.75,18.54)
TX1_HV: length 13
  Top Layer w0.254: U16.11 35.89,14.04 36.73,14.88 36.73,21.74 37.59,22.61 38.73,22.61 39.56,21.78 U4.4
TX2: length 20.2
  Top Layer w0.254: U5.2 v1(41.15,16.26) ; v1(57.02,16.13) U15.12
  Bottom Layer w0.254: v1(57.02,16.13) 56.64,15.75 41.66,15.75 v1(41.15,16.26)
TX2_HV: length 9.9
  Top Layer w0.254: U5.4 39.56,17.21 38.73,18.03 37.59,18.03 37.08,17.53 37.08,13.66 36.2,12.77 U16.10
TX232: length 9.2
  Top Layer w0.254: U15.14 58.29,18.67 57.66,18.03 53.09,18.03 52.45,17.4 U14.13
TXP: length 59.1
  Top Layer w0.254: U14.12 49.88,16.13 48.26,14.51 48.26,9.4 47.5,8.64 47.5,4.32 46.41,3.23 5.66,3.23 5.08,3.81 J5.3
UART_SEL: length 18.9
  Top Layer w0.254: U2.23 61.21,17.15 60.83,16.76 52.9,16.76 52.58,16.44 52.58,15.75 51.69,14.86 U14.11 U14.10 49.66,13.59 49.01,12.95 R14.2
VSW1: length 77.4
  Top Layer w0.254: U10.5 U10.4 ; U10.5 13.69,28.26 C21.1 ; U10.5 14.28,28.01 14.77,27.52 14.77,22.96 17.37,20.35 17.37,10.56 18.26,9.68 20.6,9.68 v1(20.83,9.91) ; v1(23.5,2.29) 24.18,1.6 57.48,1.6 v1(59.18,3.3)
  Bottom Layer w0.254: J3.4 60.48,4.6 v1(59.18,3.3) ; v1(20.83,9.91) 20.83,7.37 22.35,5.84 22.35,3.43 v1(23.5,2.29)
VSW2: length 24.1
  Top Layer w0.254: C22.1 13.69,23.18 U11.5 ; U11.5 14.3,22.93 17.02,20.21 17.02,10.41 18.11,9.32 21.08,9.32 J4.4 ; U11.5 U11.4
$1N5366: length 3.4
  Top Layer w0.254: R2.2 80.84,49.2 Q1.1
$1N5377: length 6.4
  Top Layer w0.254: LS1.2 81.81,51.96 81.81,51.61 81.79,51.59 Q1.3
$1N8540: length 1.7
  Top Layer w0.254: DS1.2 R7.1
$3N10824: length 8.6
  Top Layer w0.254: U7.2 70.25,45.36 69.85,44.96 68.33,44.96 R9.1 66.73,44.44 S4.2 66.28,45.67 C16.2
$3N11380: length 7.3
  Top Layer w0.254: U6.2 29.22,45.21 R8.1 28,44.89 S3.2 26.23,44.89 25.08,46.04 C15.2
$3N11664: length 2.5
  Top Layer w0.254: R10.1 16.76,30.99 16.54,30.76 U10.3
$3N11721: length 2.3
  Top Layer w0.254: U11.3 16.54,25.43 17.02,25.91 R11.1
$3N12960: length 3
  Top Layer w0.254: U16.6 26.87,14.04 C28.2
$3N12975: length 2.8
  Top Layer w0.254: U16.5 29.18,15.25 C30.1
$3N13045: length 4.9
  Top Layer w0.254: C31.2 30.73,21.4 30.73,19.47 30.39,19.12 U16.2
$3N13107: length 2.8
  Top Layer w0.254: U16.4 26.49,16.58 C30.2
$3N13146: length 3
  Top Layer w0.254: C29.1 26.87,17.85 U16.3
$3N13150: length 3.1
  Top Layer w0.254: U16.1 27.12,20.39 C29.2
$3N20206: length 4.2
  Top Layer w0.254: Q3.1 18.73,36.89 R16.2
$3N20207: length 2.1
  Top Layer w0.254: R15.2 15.17,36.76 Q2.1
$3N20460: length 10.2
  Top Layer w0.254: J5.1 3.81,7.11 3.81,10.16 7.37,13.72 D2.2

## Copper pours and planes (outline as drawn; the poured copper is in the pictures)
GND on Top Layer: -1.52,86.61 92.46,86.61 92.46,-16.26 -1.52,-16.26
GND on Bottom Layer: -23.11,65.53 105.66,65.53 105.66,-1.52 -23.11,-1.52

## Text on the board
Top Silkscreen Layer: GND | 5V | DTR | TX | RTS | RX | Version 2.2.1, June 24 | RIT SHED Makerspace | Design: Jim Heaney | Port | 2 | 1 | Access Control Core | EEPROM | Config | Reset | Mode
